# Altium schematic sheet 06_Clock_Configuration.SchDoc
size A; SheetNumber: 6; SheetTotal: 6
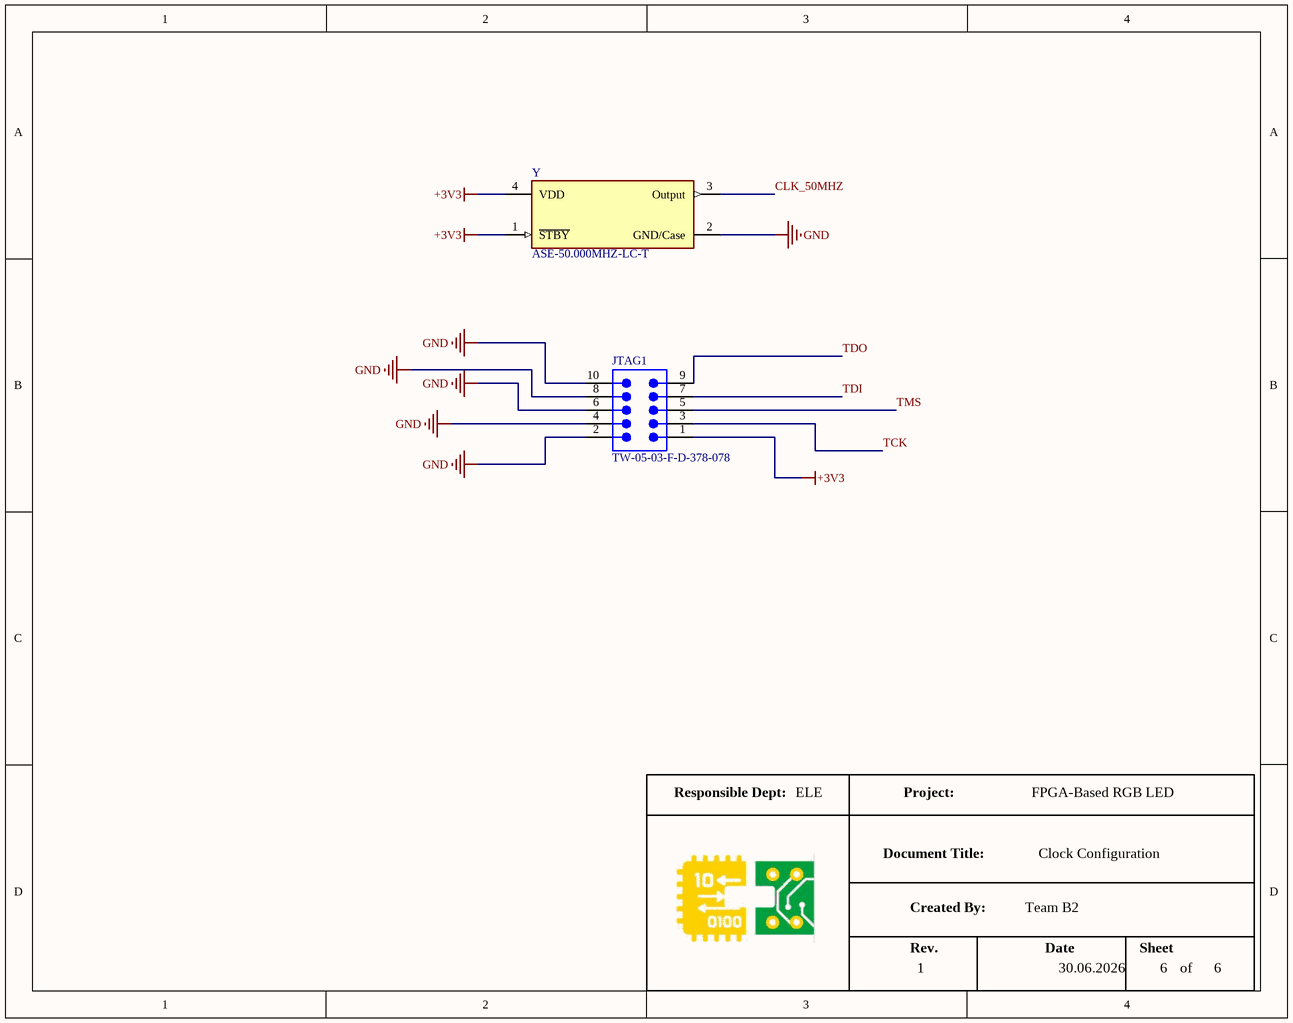
[diagram p0: 06_Clock_Configuration.SchDoc]

## Parts
JTAG1  TW-05-03-F-D-378-078  [SMTC-TW-05-03-X-D-378-078]
Y  ASE-50.000MHZ-LC-T  [FP-ASE-MFG]

## Nets
+3V3: JTAG1.1 Y.1(~{STBY}) Y.4(VDD)
GND: JTAG1.2 JTAG1.4 JTAG1.6 JTAG1.8 JTAG1.10 Y.2(GND/Case)
CLK_50MHZ: Y.3(Output)
TCK: JTAG1.3
TDI: JTAG1.7
TDO: JTAG1.9
TMS: JTAG1.5

## Notes on the sheet
- Responsible Dept:
- ELE
- Project:
- FPGA-Based RGB LED
- Document Title:
- Created By:
- Team B2
- Clock Configuration
- Rev.
- 1
- Date
- 30.06.2026
- Sheet
- 6
- of

## Library data of the parts
JTAG1 = CMP-1029-00381-1: Through-Hole Board Stacker, Vertical, -55 to 125 degC, 2 mm Pitch, 10-Pin, Male, RoHS; Manufacturer: Samtec; Pitch: 2 mm; ComponentLink3Description: Package Specification; Temperature Range: -55 to 125 degC; Mounting Technology: Through-hole; PackageReference: TW-05-03-X-D-378-078; ComponentLink3URL: http://www.samtec.com/documents/webfiles/cpdf/TW-XX-XX-X-X-XXX-XXX-XXX-XX-MKT2.pdf; PackageVersion: BF, 6/1998; PackageDescription: High Temp 2mm Terminal Strip(Board Stacking); PartNumber: TW-05-03-F-D-378-078; ComponentLink2Description: Datasheet; ComponentLink2URL: http://d2a072wq521u33.cloudfront.net/catalog_english//TW_TH.PDF; Orientation: Vertical; DatasheetVersion: F-214; RoHS: True; ComponentLink1URL: http://www.samtec.com; ComponentLink1Description: Manufacturer URL
Y = CMP-27762-009764-1: XTAL Oscillator 50MHz ±50ppm CMOS 3.3V 4-SMD 3.2mm x 2.5mm; Load Capacitance: 15pF; Max Supply Current: 19mA; Min Supply Voltage: 3.135V; Max Supply Voltage: 3.465V; Packaging: Tape and Reel; Height: 0.047inch; Mount: Surface Mount; Frequency Stability: 50ppm; Lead Free: Lead Free; Number of Pins: 4; Width: 0.098inch; Radiation Hardening: No; Max Operating Temperature: 85°C; Length: 3.2mm; REACH SVHC: No SVHC; Series: ASE; Depth: 2.5mm; Operating Supply Voltage: 3.3V; Min Operating Temperature: -40°C; Package Quantity: 1000; Operating Frequency: 50 MHz; Case/Package: SMD/SMT; Termination: SMD/SMT; Frequency: 50MHz